# EAGLE design main (EAGLE 9.1.0)
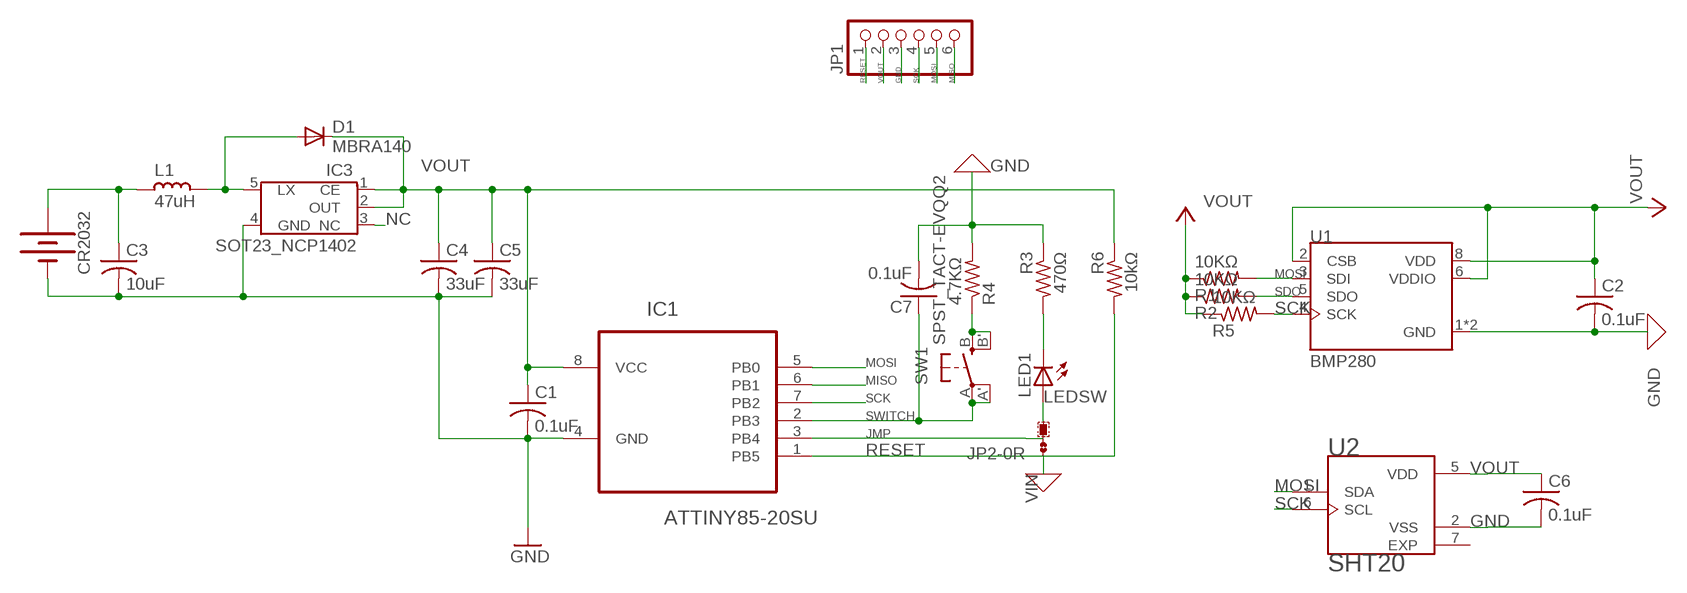
[diagram p0: schematic, sheet 1]

## Parts
C1  0.1uF  C-USC0805  [C0805]
C2  0.1uF  C-USC0805  [C0805]
C3  10uF  C-USC0805  [C0805]
C4  33uF  C-USC1210  [C1210]
C5  33uF  C-USC1210  [C1210]
C6  0.1uF  C-USC0805  [C0805]
C7  0.1uF  C-USC0805  [C0805]
CR2032  BATTERY-20MM_SMD_4LEGS  [BATTCON_20MM_4LEGS]
D1  MBRA140  DIODE-DO-214AC  [DO-214AC]
IC1  ATTINY85-20SU  [SOIC127P798X216-8N]
IC3  SOT23_NCP1402  [SOT-23-5]
JP1  PINHD-1X6  [1X06]
JP2  0R-JUMPA  [A0R-JMP]
L1  47uH  L_0805  [L0805]
LED1  LEDCHIPLED_0603  [CHIPLED_0603]
R1  10KΩ  R-US_R0805  [R0805]
R2  10KΩ  R-US_R0805  [R0805]
R3  470Ω  R-US_R0805  [R0805]
R4  4.7KΩ  R-US_R0805  [R0805]
R5  10KΩ  R-US_R0805  [R0805]
R6  10kΩ  R-US_R0805  [R0805]
SW1  SPST_TACT-EVQQ2  [EVQ-Q2]
U1  BMP280  [XDCR_BMP280]
U2  SHT20  [DFN300X300X110-7N]

## Nets
GND: C1.2 C2.2 C3.2 C4.2 C5.2 C6.2 C7.2 CR2032.NEGATIVE(-) IC1.4(GND) IC3.4(GND) JP1.3 R3.1 R4.2 U1.1(GND) U1.7(GND) U2.2(VSS)
JMP: IC1.3(PB4) JP2.2
LEDRES: LED1.C R3.2
LEDSW: JP2.3 LED1.A
LX: D1.A IC3.5(LX) L1.1
MISO: IC1.6(PB1) JP1.6
MOSI: IC1.5(PB0) JP1.5 R1.2 U1.3(SDI) U2.1(SDA)
NC: IC3.3(NC)
RESET: IC1.1(PB5) JP1.1 R6.2
SCK: IC1.7(PB2) JP1.4 R5.2 U1.4(SCK) U2.6(SCL)
SDO: R2.2 U1.5(SDO)
SWITCH: C7.1 IC1.2(PB3) SW1.A'(P1) SW1.A(P)
SWITCHRES: R4.1 SW1.B'(S1) SW1.B(S)
VIN: C3.1 CR2032.POSITIVE@1(+) CR2032.POSITIVE@2(+) CR2032.POSITIVE@3(+) CR2032.POSITIVE@4(+) JP2.1 L1.2 ; supply symbol labelled GND
VOUT: C1.1 C2.1 C4.1 C5.1 C6.1 D1.C IC1.8(VCC) IC3.1(CE) IC3.2(OUT) JP1.2 R1.1 R2.1 R5.1 R6.1 U1.2(CSB) U1.6(VDDIO) U1.8(VDD) U2.5(VDD) ; supply symbol labelled VCC
Unconnected: U2.7(EXP)

## Library data of the parts
C1 C2 C6 C7 = rcl:C-US: CAPACITOR, American symbol
C3-C5 = adafruit:C-US: CAPACITOR, American symbol
CR2032 = SparkFun-Batteries:BATTERY: Battery - Single Cell A variety of battery chemistries, sizes, and footprints. Device List: 20MM_PTH - Coin Cell Battery Holder - 20mm (PTH) <https://www.sparkfun.com/products/783> 6.8MM_PTH - Coin Cell Battery Holder - 6.8MM(SMD) <https://www.digikey.com/product-detail/en/seiko-instruments/MS621FE-FL11E/728-1057-ND/1889208?WT.srch=1&gclid=CNOQ5a6LzdQCFZS2wAodXCkE0g> 12MM_SMD - Coin Cell Battery Holder - 12mm (SMD) <https://www.sparkfun.com/products/10592> 12MM_PTH - Coin Cell Battery Holder - 12mm (PTH) <https://www.sparkfun.com/products/7948> 20MM_SMD - 20mm Coin Cell Battery Holder (SMD) (2 legs) Used on the Big Time Watch Kit <https://www.sparkfun.com/products/11734> 20MM_SMD_4LEGS - Coin Cell Battery Holder - 20mm (SMD) <https://www.sparkfun.com/products/11892> 20MM_SMD_4LEGS_OVERPASTE - Coin Cell Battery Holder - 20mm (SMD) <https://www.sparkfun.com/products/11892> (Over-paste on the legs) 24.5MM_PTH - Coin Cell Battery Holder - 24.5mm (PTH) <https://www.sparkfun.com/products/8863> 9V - 9V Battery Holder - PC Mount Used on the SparkFun SparkPunk Sound Kit <https://www.sparkfun.com/products/11177> and SparkFun SparkPunk Sequencer Kit <https://www.sparkfun.com/products/12707> 18650 - Battery Holder - 18650 (PTH) <https://www.sparkfun.com/products/13113> AA - Battery Holder - 1xAA (PTH) <https://www.sparkfun.com/products/7949> AAA - Battery Holder - 1xAAA (PTH) <https://www.sparkfun.com/products/12718> AA_KIT - Battery Holder - 1xAA (PTH) <https://www.sparkfun.com/products/7949> Special kit package - pads only have exposed copper on one side of the board. AAA_KIT - Battery Holder - 1xAAA (PTH) <https://www.sparkfun.com/products/12718> Special kit package - pads only have exposed copper on one side of the board.; PROD_ID: BATT-10373; SF_SKU: PRT-11892
D1 = diode:DIODE-: DIODE
IC1 = Atmel_By_element14_Batch_1-00:ATTINY85-20SU: 8-bit Microcontroller with In-System Programmable Flash; MPN: ATTINY85-20SU; OC_FARNELL: 1455164; OC_NEWARK: 58M3797; PACKAGE: SOIC-8; SUPPLIER: Atmel
IC3 = 1dmf:SOT23_NCP1402
JP1 = pinhead:PINHD-1X6: PIN HEADER
JP2 = jump-0r-smd:0R-JUMP: SMD 0R 0805 Jumper
L1 = rc-master:L_: INDUCTOR
LED1 = adafruit:LED: LED OSRAM: - CHIPLED LG R971, LG N971, LY N971, LG Q971, LY Q971, LO R971, LY R971 LH N974, LH R974 LS Q976, LO Q976, LY Q976 LO Q996 - Hyper CHIPLED LW Q18S LB Q993, LB Q99A, LB R99A - SideLED LS A670, LO A670, LY A670, LG A670, LP A670 LB A673, LV A673, LT A673, LW A673 LH A674 LY A675 LS A676, LA A676, LO A676, LY A676, LW A676 LS A679, LY A679, LG A679 - Hyper Micro SIDELED® LS Y876, LA Y876, LO Y876, LY Y876 LT Y87S - SmartLED LW L88C, LW L88S LB L89C, LB L89S, LG L890 LS L89K, LO L89K, LY L89K LS L896, LA L896, LO L896, LY L896 - TOPLED LS T670, LO T670, LY T670, LG T670, LP T670 LSG T670, LSP T670, LSY T670, LOP T670, LYG T670 LG T671, LOG T671, LSG T671 LB T673, LV T673, LT T673, LW T673 LH T674 LS T676, LA T676, LO T676, LY T676, LB T676, LH T676, LSB T676, LW T676 LB T67C, LV T67C, LT T67C, LS T67K, LO T67K, LY T67K, LW E67C LS E67B, LA E67B, LO E67B, LY E67B, LB E67C, LV E67C, LT E67C LW T67C LS T679, LY T679, LG T679 LS T770, LO T770, LY T770, LG T770, LP T770 LB T773, LV T773, LT T773, LW T773 LH T774 LS E675, LA E675, LY E675, LS T675 LS T776, LA T776, LO T776, LY T776, LB T776 LHGB T686 LT T68C, LB T68C - Hyper Mini TOPLED® LB M676 - Mini TOPLED Santana® LG M470 LS M47K, LO M47K, LY M47K Source: http://www.osram.convergy.de/
R1-R6 = adafruit:R-US_: RESISTOR, American symbol
SW1 = adafruit:SPST_TACT: SMT 6mm switch, EVQQ2 series http://www.ladyada.net/library/eagle
U1 = BMP280:BMP280: BMP280 Absolute Barometric Pressure Sensor for Battery Powered Devices 2 x 2.5mm; DESCRIPTION: BMP280 Absolute Barometric Pressure Sensor for Battery Powered Devices 2 x 2.5mm; DIGI-KEY_PART_NUMBER: 828-1064-1-ND; DIGI-KEY_PURCHASE_URL: https://www.digikey.com.au/product-detail/en/bosch-sensortec/BMP280/828-1064-1-ND/6136315?utm_source=snapeda&utm_medium=aggregator&utm_campaign=symbol; MF: Bosch; MP: BMP280; PACKAGE: SMD-8 Bosch Tools
U2 = SHT20:SHT20: SHT20 3.6 V -40 to +125°C Fully Calibrated Digital Humidity & Temperature Sensor; AVAILABILITY: Unavailable; DESCRIPTION: SHT20 3.6 V -40 to +125°C Fully Calibrated Digital Humidity & Temperature Sensor; MF: Sensirion; MP: SHT20; PACKAGE: DFN-6 Sensirion; PRICE: None

## Board
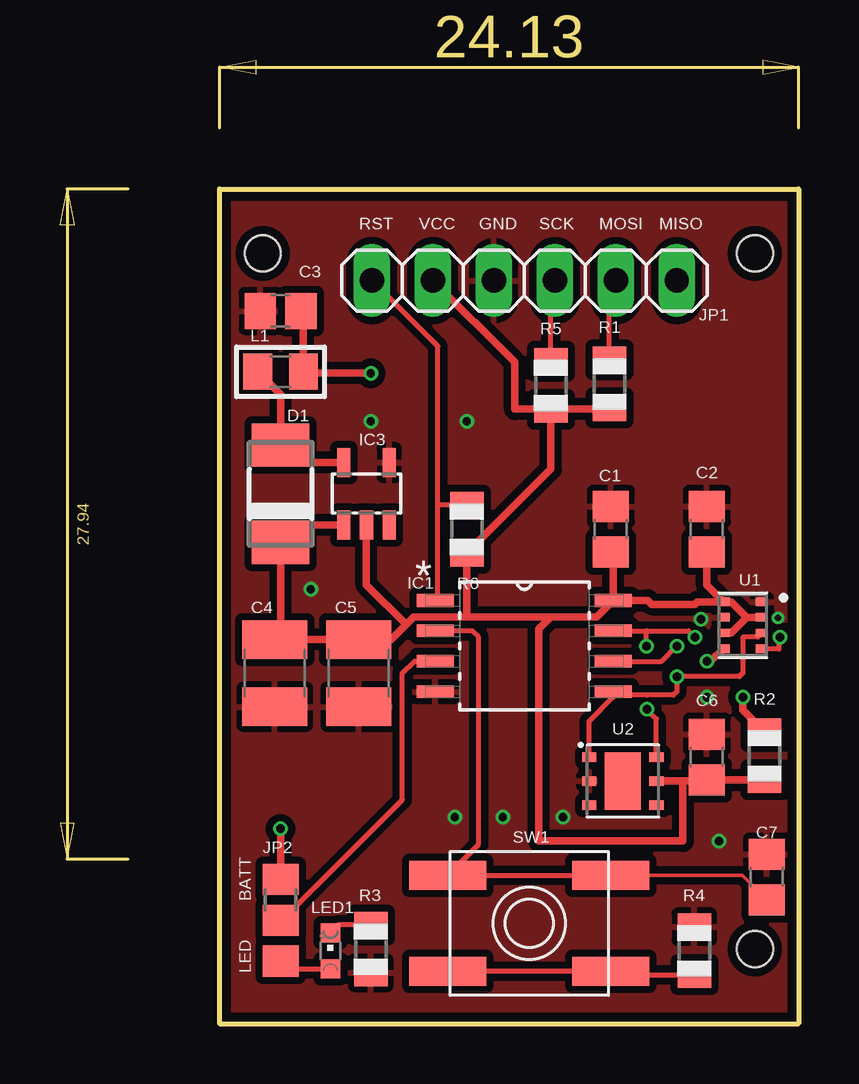
[diagram p1: board, top side]
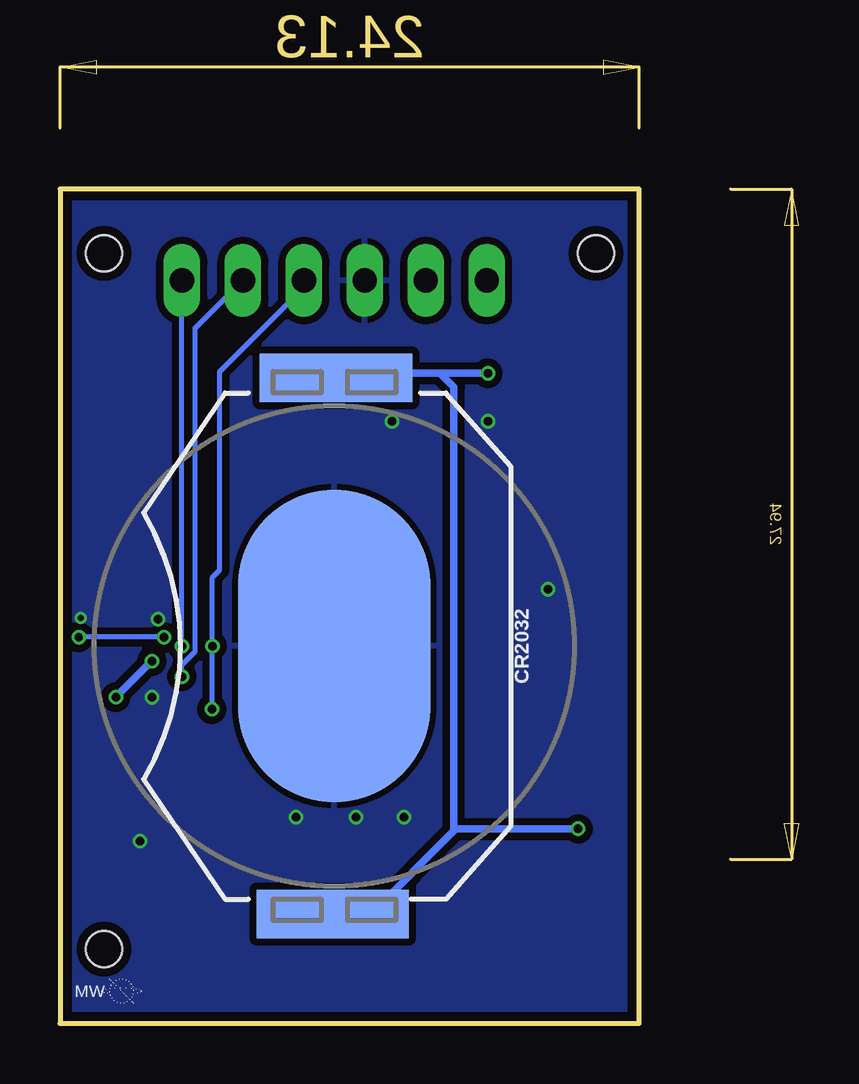
[diagram p2: board, bottom side, seen from below]

Size 24.13 x 34.79 mm. Coordinates in mm from the lower left corner, seen from the top.
Outline: 0,0 24.13,0 24.13,34.79 0,34.79 0,0
Copper layers (1*16): Top 0.035559375mm / dielectric 1.6mm / Bottom 0.035559375mm
Design rules "oshpark-2layer": minimum track width 6mil, minimum drill 10mil, track to track 6mil, track to pad 6mil, pad to pad 6mil, via to via 6mil, smd to smd 6mil, copper to edge 15mil, drill to drill 6mil, minimum pad ring 5mil, minimum via ring 5mil, stop-mask expansion 2.5mil, vias tented up to drill 0mil, thermal gap 10mil
Holes 1.5 mm at 22.3,3.11 1.8,32.11 22.3,32.11

### Footprints (pad centres in the part's own frame; a part is rotated, then mirrored left to right if it is on the bottom)
C0805 = smd 1.3 x 1.5: 1 -0.95,0; 2 0.95,0
C0805' = smd 1.3 x 1.5: 1 -0.85,0; 2 0.85,0
C1210 = smd 1.6 x 2.7: 1 -1.4,0; 2 1.4,0
BATTCON_20MM_4LEGS = smd 13 x 8: NEGATIVE 0,0 | smd 2.032 x 3.175: POSITIVE@1 -11.176,1.651; POSITIVE@2 -11.176,-1.524; POSITIVE@3 11.176,1.524; POSITIVE@4 11.176,-1.651
DO-214AC = smd 1.8 x 2.4: A 2.025,0; C -2.025,0
SOIC127P798X216-8N = smd 1.549 x 0.533: 1 -3.708,1.905; 2 -3.708,0.635; 3 -3.708,-0.635; 4 -3.708,-1.905; 5 3.708,-1.905; 6 3.708,-0.635; 7 3.708,0.635; 8 3.708,1.905
SOT-23-5 = smd 0.55 x 1.2: 1 -0.95,-1.3; 2 0,-1.3; 3 0.95,-1.3; 4 0.95,1.3; 5 -0.95,1.3
1X06 = drill 1.016 long: 1 -6.35,0; 2 -3.81,0; 3 -1.27,0; 4 1.27,0; 5 3.81,0; 6 6.35,0
A0R-JMP = smd 1.5 x 1.3: 1 0,1.7; 2 0,0; 3 0,-1.7
L0805 = smd 1.2 x 1.5: 1 -0.953,0; 2 0.953,0
CHIPLED_0603 = smd 0.8 x 0.8: A 0,-0.75; C 0,0.75
R0805 = smd 1.1 x 1.4: 1 -1,0; 2 1,0
EVQ-Q2 = smd 3.2 x 1.2: A -3.4,-2; A' 3.4,-2; B -3.4,2; B' 3.4,2
XDCR_BMP280 = smd 0.5 x 0.35: 1 0.8,0.975; 2 0.8,0.325; 3 0.8,-0.325; 4 0.8,-0.975; 5 -0.8,-0.975; 6 -0.8,-0.325; 7 -0.8,0.325; 8 -0.8,0.975
DFN300X300X110-7N = smd 0.6 x 0.4: 1 -1.4,1; 2 -1.4,0; 3 -1.4,-1; 4 1.4,-1; 5 1.4,0; 6 1.4,1 | smd 1.5 x 2.4: 7 0,0

### Placement (x,y rotation side)
C1  16.3,20.61 90 top
C2  20.3,20.61 90 top
C3  10uF  [C0805']  2.54,29.71 180 top
C4  2.3,14.61 270 top
C5  5.8,14.61 270 top
C6  20.3,11.11 90 top
C7  22.8,6.11 90 top
CR2032  12.7,15.74 270 bottom
D1  2.54,22.09 90 top
IC1  12.7,15.74 0 top
IC3  6.12,22.09 0 top
JP1  12.7,30.98 0 top
JP2  2.54,4.31 0 top
L1  2.54,27.17 0 top
LED1  4.62,3.04 0 top
R1  16.24,26.67 90 top
R2  22.7,11.17 90 top
R3  6.3,3.11 90 top
R4  19.78,3.04 90 top
R5  13.8,26.61 90 top
R6  10.3,20.61 90 top
SW1  12.9,4.18 180 top
U1  21.8,16.61 0 top
U2  16.8,10.11 0 top

### Tracks (layer width: path | path; a pad name or v marks a point on that pad's centre or on a via)
GND  (via drill 0.25, 0.35)
  other vias: 6.3,25.11 3.8,18.11 10.3,25.11 14.3,8.61 20.3,13.61 20.05,16.86 11.8,8.61 23.27,16.91 9.8,8.61 20.8,7.61
  pour Top (isolate 0.305): -1.27,36.06 25.4,36.06 25.4,-0.77 -1.27,-0.77
  pour Bottom (isolate 0.305): -2.54,37.33 26.67,37.33 26.67,-2.04 -2.54,-2.04
JMP
  Top 0.2: IC1.3 8.12,15.11 7.62,14.61 7.62,9.33 4.47,6.19 2.6,4.31 JP2.2
LEDRES
  Top 0.2: R3.2 4.94,4.11 LED1.C
LEDSW
  Top 0.2: JP2.3 2.86,2.29 LED1.A
LX
  Top 0.305: IC3.5 3.27,23.39 D1.A 2.54,26.22 L1.1
MISO  (via drill 0.35)
  Top 0.2: IC1.6 18.41,15.11 v19.05,15.74
  Bottom 0.2: v19.05,15.74 JP1.6
MOSI  (via drill 0.35)
  Top 0.2: R1.2 16.24,30.71 JP1.5 | U1.3 22.43,16.11 21.8,16.11 21.8,14.61 21.66,14.47 v19.05,14.47 19.05,13.84 18.91,13.69 17.8,13.69 16.55,13.69 IC1.5 16.41,13.61 15.4,12.6 U2.1
  Bottom 0.2: v19.05,14.47 19.05,14.96 18.5,15.51 18.5,28.99 JP1.5
RESET
  Top 0.2: JP1.1 9.1,28.23 9.1,21.61 | IC1.1 9.1,17.75 9.1,21.61 | R6.2 9.1,21.61
SCK  (via drill 0.35)
  Top 0.2: IC1.7 17.78,16.38 | v17.78,15.74 17.78,16.38 | 17.78,16.38 19.54,16.38 v19.8,16.11 | v23.35,16.11 23.3,16.06 23.3,15.61 22.63,15.61 U1.4 | R5.2 13.8,30.81 JP1.4 | U2.6 18.2,12.71 v17.8,13.11
  Bottom 0.2: JP1.4 13.97,30.67 17.48,27.17 17.48,18.9 17.78,18.6 v17.78,15.74 17.78,13.13 v17.8,13.11 | v19.8,16.11 v23.35,16.11
SDO  (via drill 0.35)
  Top 0.305: R2.2 21.8,13.07 v21.8,13.61 | v20.3,15.11 20.47,15.11 U1.5
  Bottom 0.305: v21.8,13.61 v20.3,15.11
SWITCH
  Top 0.152: SW1.A 21.78,6.18 C7.1
  Top 0.2: SW1.A SW1.A' 10.8,7.47 10.8,16.11 10.53,16.38 IC1.2
SWITCHRES
  Top 0.2: SW1.B' SW1.B 16.44,2.04 R4.1
VIN  (via drill 0.35)
  Top 0.305: C3.1 3.49,29.61 L1.2 3.55,27.11 v6.3,27.11 | JP2.1 v2.54,8.12
  Bottom 0.2: 6.35,27.11 arc-260 v6.3,27.11
  Bottom 0.305: 8.3,27.11 10.86,27.11 CR2032.POSITIVE@1 CR2032.POSITIVE@2 | 8.3,27.11 6.35,27.11 | 7.71,8.02 7.62,8.12 v2.54,8.12 | 7.71,8.02 7.71,26.52 8.3,27.11 | 7.71,8.02 CR2032.POSITIVE@3 CR2032.POSITIVE@4
VOUT
  Top 0.305: IC1.8 15.71,16.95 13.8,16.95 | 7.78,16.63 7.15,16.01 C5.1 C4.1 2.54,16.25 D1.C 3.27,20.79 IC3.1 | 7.78,16.63 8.09,16.95 10.3,16.95 | 10.3,16.95 13.8,16.95 | IC1.8 17.84,17.64 18.01,17.48 19.8,17.48 19.9,17.59 U1.8 | JP1.2 12.3,27.57 12.3,25.61 R5.1 | 7.78,16.63 6.12,18.29 IC3.2 | U1.2 21.97,16.93 | U1.8 21.32,17.59 21.97,16.93 | U1.6 21.32,16.29 21.97,16.93 | R1.1 16.18,25.61 R5.1 | 19.3,10.11 20.25,10.11 C6.1 R2.1 | 19.3,10.11 U2.5 | 19.3,10.11 19.3,7.61 13.3,7.61 13.3,16.45 13.8,16.95 | U1.8 20.3,18.29 C2.1 | IC1.8 16.41,19.55 C1.1 | 10.3,16.95 R6.1 13.8,23.11 R5.1

### Text on the board
tNames: RST | VCC | GND | SCK | MOSI | MISO | BATT | LED
bNames: MW
Document: 12/08/2018 | Handheld environment sensor | V1.0